# EAGLE design MYC_Klimasensor_small (EAGLE 7.3.0)
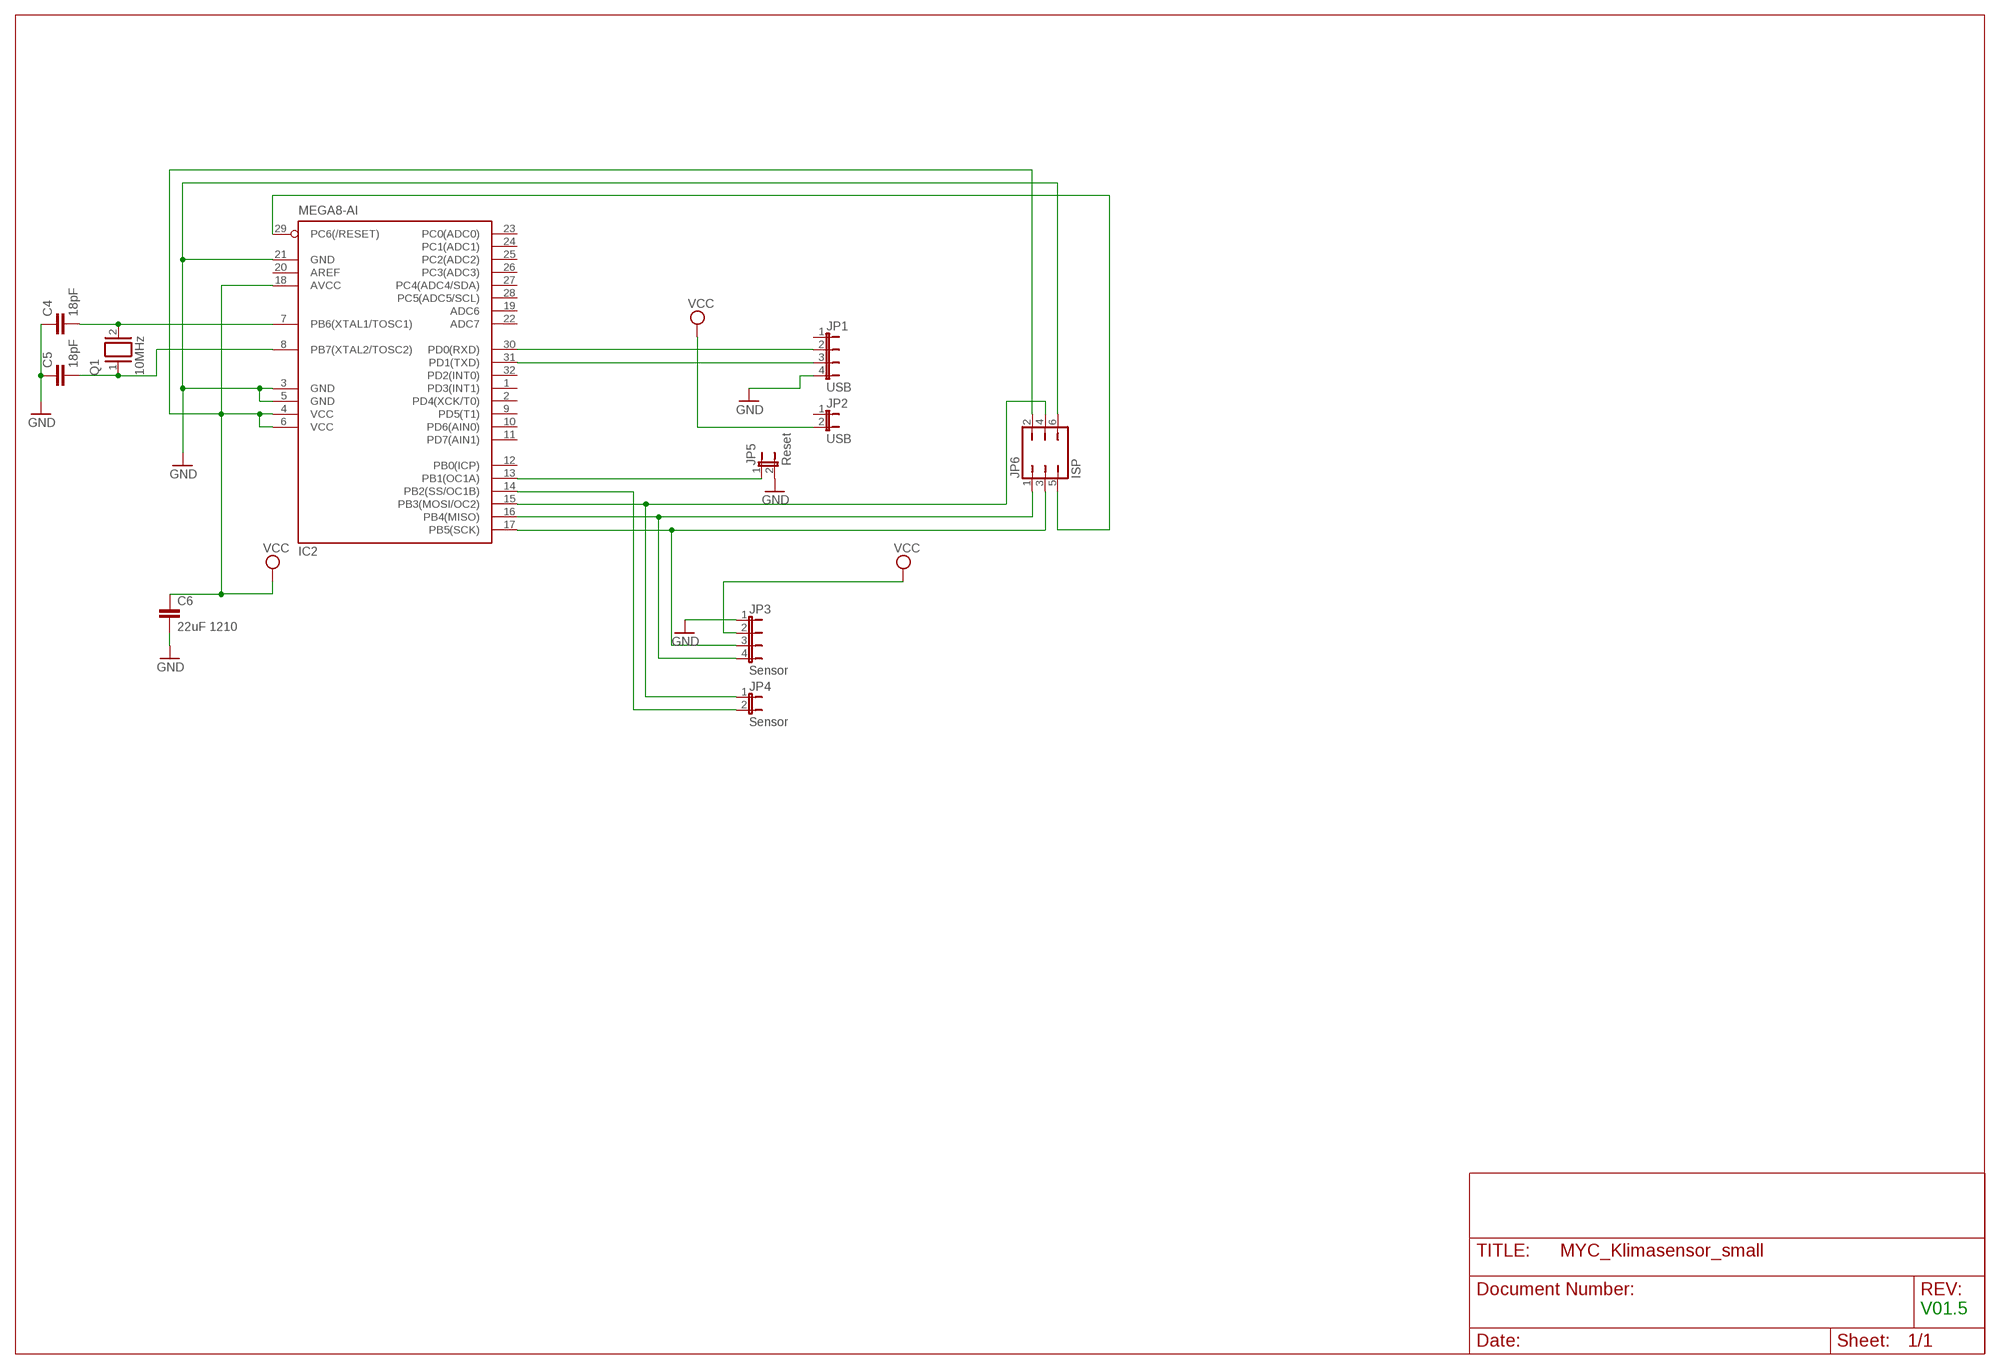
[diagram p0: schematic, sheet 1]

## Parts
C4  18pF  C-EU025-025X050  [C025-025X050]
C5  18pF  C-EU025-025X050  [C025-025X050]
C6  22uF 1210  C-EUC1206  [C1206]
IC2  MEGA8-AI  [TQFP32-08]
JP1  USB  JP4E  [JP4]
JP2  USB  JP1E  [JP1]
JP3  Sensor  JP4E  [JP4]
JP4  Sensor  JP1E  [JP1]
JP5  Reset  JP1E  [JP1]
JP6  ISP  JP3Q  [JP3Q]
Q1  10MHz  XTAL/S  [QS]

## Nets
GND: C4.1 C5.1 C6.2 IC2.3(GND) IC2.5(GND) IC2.21(GND) JP1.4 JP3.1 JP5.2 JP6.6
N$1: IC2.17(PB5(SCK)) JP3.3 JP6.3
N$2: IC2.15(PB3(MOSI/OC2)) JP4.1 JP6.4
N$3: IC2.14(PB2(SS/OC1B)) JP4.2
N$4: IC2.30(PD0(RXD)) JP1.2
N$9: IC2.13(PB1(OC1A)) JP5.1
N$10: IC2.31(PD1(TXD)) JP1.3
N$15: IC2.16(PB4(MISO)) JP3.4 JP6.1
N$18: IC2.29(PC6(/RESET)) JP6.5
N$19: C4.2 IC2.7(PB6(XTAL1/TOSC1)) Q1.2
N$37: C5.2 IC2.8(PB7(XTAL2/TOSC2)) Q1.1
VCC: C6.1 IC2.4(VCC) IC2.6(VCC) IC2.18(AVCC) JP2.2 JP3.2 JP6.2
Unconnected: IC2.1(PD3(INT1)) IC2.2(PD4(XCK/T0)) IC2.9(PD5(T1)) IC2.10(PD6(AIN0)) IC2.11(PD7(AIN1)) IC2.12(PB0(ICP)) IC2.19(ADC6) IC2.20(AREF) IC2.22(ADC7) IC2.23(PC0(ADC0)) IC2.24(PC1(ADC1)) IC2.25(PC2(ADC2)) IC2.26(PC3(ADC3)) IC2.27(PC4(ADC4/SDA)) IC2.28(PC5(ADC5/SCL)) IC2.32(PD2(INT0)) JP1.1 JP2.1

## Notes on the sheet
- V01.5

## Library data of the parts
C4 C5 = resistor:C-EU: CAPACITOR, European symbol
C6 = rcl:C-EU: CAPACITOR, European symbol
IC2 = atmel:MEGA8: MICROCONTROLLER 8 Kbytes FLASH, 1 kbytes SRAM, 512 bytes EEPROM, USART, 6-channel 10 bit ADC, 2-channel 8 bit ADC Pin compatible with Atmega48, ATMega88, ATMega168 Source: avr.lbr; MPN: ATMEGA8-16AU; OC_FARNELL: 9171371; OC_NEWARK: 73M8863
JP1 JP3 = jumper:JP4E: JUMPER
JP2 JP4 JP5 = jumper:JP1E: JUMPER
JP6 = jumper:JP3Q: JUMPER
Q1 = special:XTAL/S: CRYSTAL

## Board
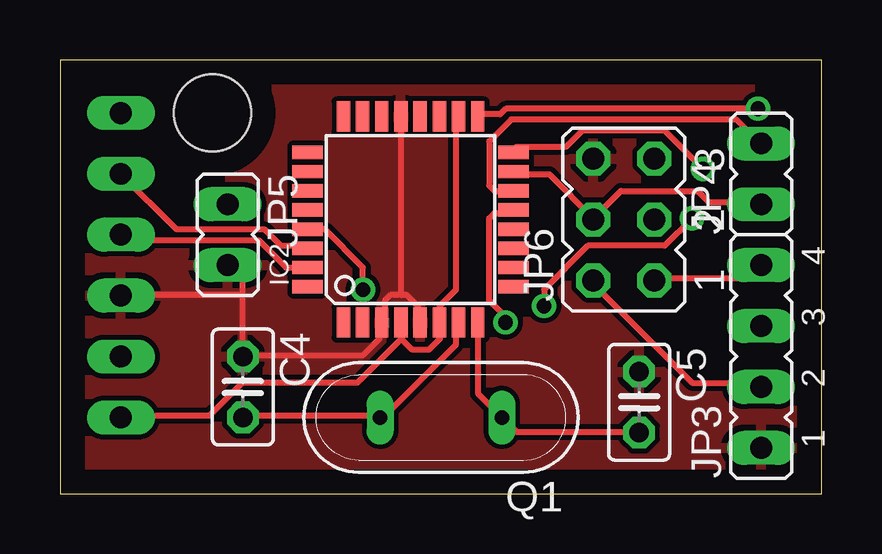
[diagram p1: board, top side]
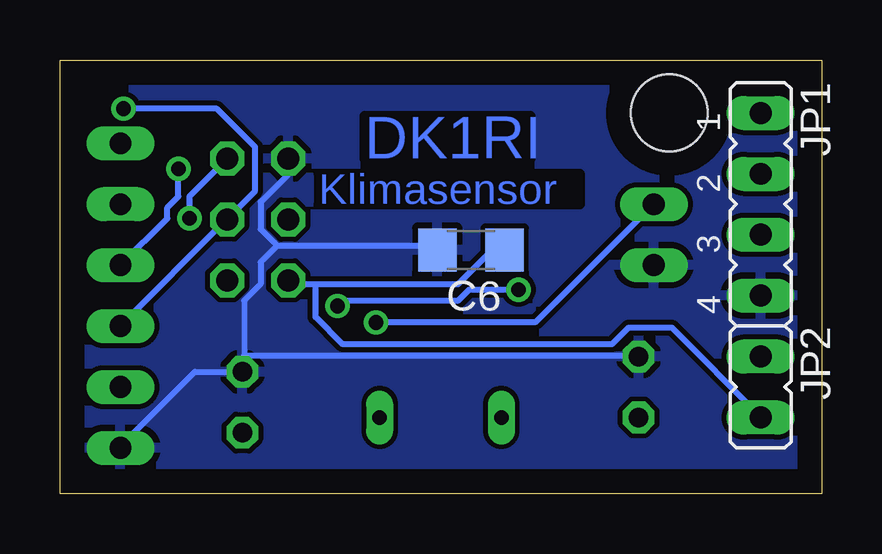
[diagram p2: board, bottom side, seen from below]

Size 31.73 x 18.09 mm. Coordinates in mm from the lower left corner, seen from the top.
Outline: 0,0 31.73,0 31.73,18.09 0,18.09 0,0
Copper layers (1*16): Top 0.035mm / dielectric 1.5mm / Bottom 0.035mm
Design rules "default": minimum track width 10mil, minimum drill 24mil, track to track 8mil, track to pad 8mil, pad to pad 8mil, via to via 8mil, smd to smd 8mil, copper to edge 40mil, drill to drill 8mil, minimum pad ring 10mil, minimum via ring 8mil, stop-mask expansion 4mil, vias tented up to drill 0mil, thermal gap 10mil
Holes 3.2 mm at 6.35,15.88

### Footprints (pad centres in the part's own frame; a part is rotated, then mirrored left to right if it is on the bottom)
C025-025X050 = drill 0.813 octagon: 1 -1.27,0; 2 1.27,0
C1206 = smd 1.6 x 1.8: 1 -1.4,0; 2 1.4,0
TQFP32-08 = smd 1.27 x 0.559: 1 -4.293,2.8; 2 -4.293,2; 3 -4.293,1.2; 4 -4.293,0.4; 5 -4.293,-0.4; 6 -4.293,-1.2; 7 -4.293,-2; 8 -4.293,-2.8; 17 4.293,-2.8; 18 4.293,-2; 19 4.293,-1.2; 20 4.293,-0.4; 21 4.293,0.4; 22 4.293,1.2; 23 4.293,2; 24 4.293,2.8 | smd 0.559 x 1.27: 9 -2.8,-4.293; 10 -2,-4.293; 11 -1.2,-4.293; 12 -0.4,-4.293; 13 0.4,-4.293; 14 1.2,-4.293; 15 2,-4.293; 16 2.8,-4.293; 25 2.8,4.293; 26 2,4.293; 27 1.2,4.293; 28 0.4,4.293; 29 -0.4,4.293; 30 -1.2,4.293; 31 -2,4.293; 32 -2.8,4.293
JP4 = drill 0.914 long: 1 -3.81,0; 2 -1.27,0; 3 1.27,0; 4 3.81,0
JP1 = drill 0.914 long: 1 0,-1.27; 2 0,1.27
JP3Q = drill 0.914 octagon: 1 -2.54,-1.27; 2 -2.54,1.27; 3 0,-1.27; 4 0,1.27; 5 2.54,-1.27; 6 2.54,1.27
QS = drill 0.61 long: 1 -2.54,0; 2 2.54,0

### Placement (x,y rotation side)
C4  7.62,4.45 270 top
C5  24.13,3.81 270 top
C6  14.61,10.16 180 bottom
IC2  14.61,11.43 90 top
JP1  2.54,12.06 270 bottom
JP2  2.54,4.45 180 bottom
JP3  29.21,5.71 90 top
JP4  29.21,13.34 0 top
JP5  6.98,10.8 180 top
JP6  23.5,11.43 90 top
Q1  15.88,3.17 180 top

### Tracks (layer width: path | path; a pad name or v marks a point on that pad's centre or on a via)
GND
  Top 0.254: 14.22,8.28 14.45,8.28 14.91,7.82 14.91,7.14 IC2.5 | 14.22,8.28 13.77,8.28 13.54,8.05 13.54,7.14 IC2.3 13.31,7.14 13.31,6.45 12.62,5.77 7.82,5.77 C4.1 7.6,5.77 7.6,8.28 | 14.22,8.28 14.22,15.6 IC2.21 | 7.6,8.28 7.6,8.97 7.14,9.42 JP5.2 | 7.6,8.28 2.57,8.28 JP1.4
  Bottom 0.254: JP3.1 29.08,2.11 26.11,5.08 C5.1 24.05,5.08 24.05,5.77 | 22.68,10.34 16.05,10.34 C6.2 | 22.68,10.34 23.37,11.02 23.37,12.17 22.23,13.31 JP6.6 | 24.05,5.77 24.05,8.05 23.37,8.74 23.37,9.65 22.68,10.34 | 24.05,5.77 7.82,5.77 C4.1
  pour Bottom: 31.12,17.14 0.64,17.14 0.64,0.63 31.12,0.63
  pour Top: 31.12,17.14 0.64,17.14 0.64,0.63 31.12,0.63
N$1  (via drill 0.61)
  Top 0.254: v29.08,16.05 18.57,16.05 18.34,15.82 17.42,15.82 IC2.17
  Bottom 0.254: v29.08,16.05 25.2,16.05 23.6,14.45 23.6,12.62 24.74,11.48 JP6.3 24.97,11.25 29.08,7.14 JP3.3
N$2
  Top 0.254: 22.23,11.48 20.4,13.31 19.03,13.31 IC2.15 | 22.23,11.48 23.37,12.62 26.57,12.62 27.03,12.17 29.08,12.17 JP4.1 | 22.23,11.48 JP6.4
N$3
  Top 0.254: IC2.14 18.8,12.62 18.11,12.62 17.88,12.85 17.88,14.68 18.8,15.6 28.17,15.6 29.08,14.68 JP4.2
N$4
  Top 0.254: JP1.2 4.85,11.02 8.51,11.02 9.2,10.34 10.11,10.34 IC2.30
N$9  (via drill 0.61)
  Top 0.254: v18.57,7.14 18.57,7.37 17.88,8.05 17.88,11.48 18.11,11.71 18.8,11.71 IC2.13
  Bottom 0.254: v18.57,7.14 11.94,7.14 7.14,11.94 JP5.1
N$10
  Top 0.254: IC2.31 10.11,9.42 9.42,9.42 8.28,10.57 2.79,10.57 2.57,10.8 JP1.3
N$15  (via drill 0.61)
  Top 0.254: v26.8,13.54 25.2,15.14 21.77,15.14 21.08,14.45 19.03,14.45 IC2.16 | JP6.1 24.97,8.97 28.63,8.97 29.08,9.42 JP3.4
  Bottom 0.254: v26.8,13.54 26.8,12.39 27.25,11.94 27.25,11.48 JP3.4
N$18  (via drill 0.61)
  Top 0.254: v12.62,8.51 12.62,9.42 11.02,11.02 10.34,11.02 IC2.29 | v20.17,7.82 20.17,8.51 22,10.34 25.2,10.34 v26.34,11.48
  Bottom 0.254: v12.62,8.51 14.68,8.51 15.14,8.05 19.94,8.05 v20.17,7.82 | v26.34,11.48 26.34,12.39 JP6.5
N$19
  Top 0.254: IC2.7 16.51,7.14 16.51,6.22 13.54,3.25 Q1.2 13.31,3.25 7.82,3.25 C4.2
N$37
  Top 0.254: IC2.8 17.42,7.14 17.42,4.17 Q1.1 19.03,2.56 24.05,2.56 C5.2
VCC
  Top 0.254: JP3.2 29.08,4.62 26.34,4.62 22.23,8.74 JP6.2 | 14.22,6.45 14.22,7.14 IC2.4 | 14.22,6.45 14.68,5.99 15.37,5.99 15.82,6.45 15.82,7.14 | 15.82,7.14 15.82,7.82 16.51,8.51 16.51,15.6 IC2.18 | 15.82,7.14 IC2.6 | 14.22,6.45 12.4,4.62 7.6,4.62 6.22,3.25 2.57,3.25 JP2.2
  Bottom 0.254: 21.08,8.74 22.23,8.74 JP6.2 | 21.08,8.74 15.14,8.74 13.77,10.11 13.31,10.11 C6.1 | 21.08,8.74 21.08,7.37 19.94,6.22 8.74,6.22 8.05,6.91 6.22,6.91 2.57,3.25 JP2.2

### Text on the board
Bottom: DK1RI | Klimasensor